# EasyEDA Pro project Rpi power and fan.eprj

# Schematic Schematic1
Board Name: Board1; Create Date: 2025-11-11; Page Name: P1; Project Name: Rpi power and fan; Schematic Name: Schematic1; Update Date: 2025-11-11; Company: EasyEDA.com; Page Size: A4; Version: V1.0
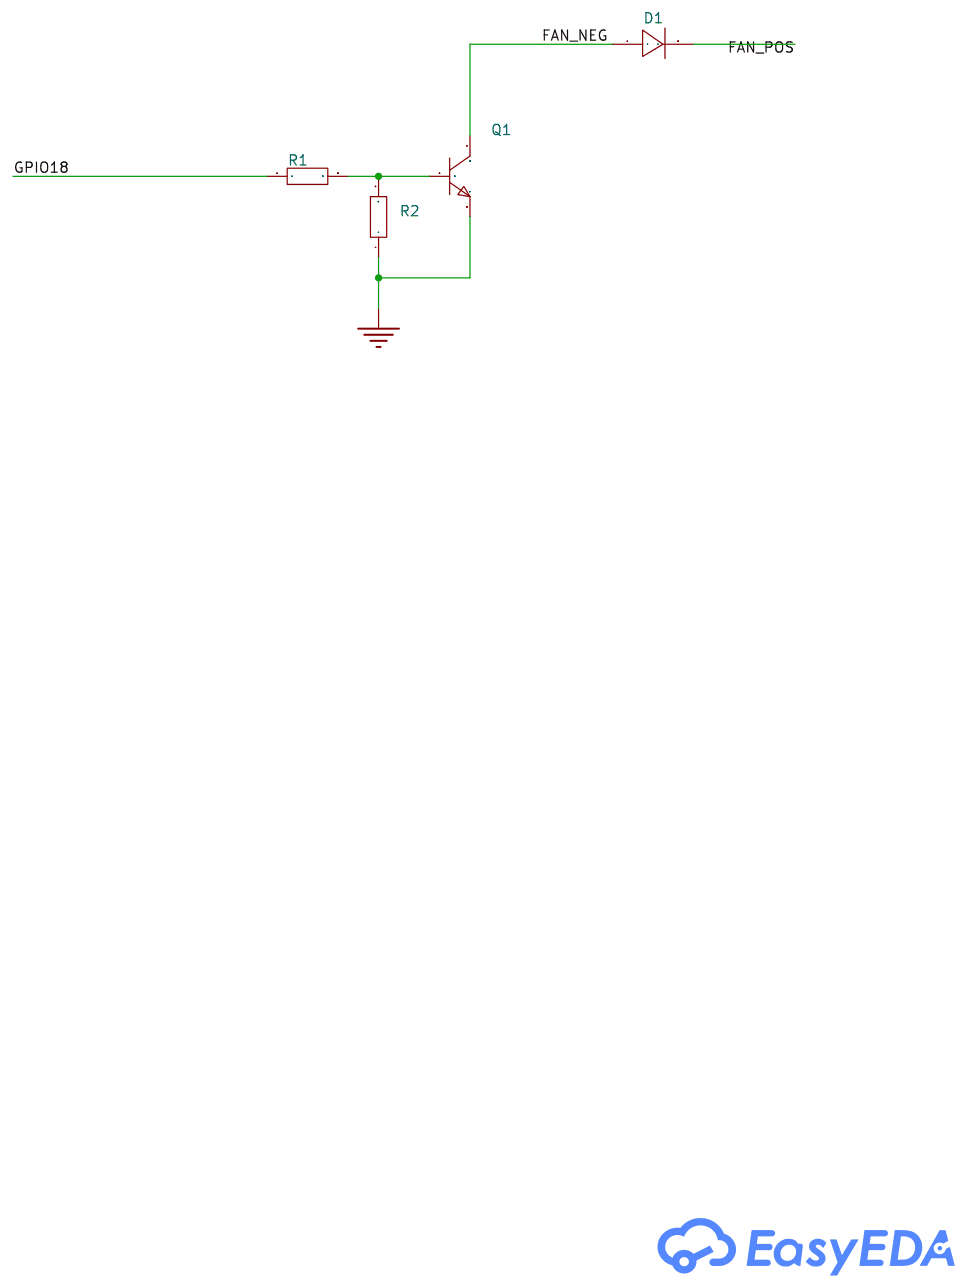
[diagram p0: schematic sheet]

## Parts
D1  -  [DO-41_BD2.8-L4.2-P8.00-D0.7-FD]
Q1  -  [TO-92-3_L4.8-W3.7-P2.54-L]
R1  2.4kΩ  [R0402]
R2  10kΩ  [R0805]

## Library data of the parts
D1 = UF4007: LCSC Part Name: 1kV 1A 75ns; Supplier Part: C232764; Manufacturer: onsemi(安森美); Supplier Footprint: DO-41; JLCPCB Part Class: Extended Part; Datasheet: https://atta.szlcsc.com/upload/public/pdf/source/20181222/C232764_DCD93948AF2F445729824FC64E235A98.pdf; Supplier: LCSC; Forward Voltage (Vf@If): 1.7V@1A; Reverse Leakage Current: 10μA@1kV; Operating Temperature: -65℃~+150℃@(Tj)
Q1 = BC547BTA: Supplier Part: C258144; Manufacturer: onsemi(安森美); Supplier Footprint: TO-92-3L; JLCPCB Part Class: Extended Part; Datasheet: https://atta.szlcsc.com/upload/public/pdf/source/20181011/C258144_558FF79AFD5DFF45A84CD9911C86EE0E.pdf; Supplier: LCSC; Collector-Emitter Saturation Voltage (VCE(sat)@Ic,Ib): 250mV@100mA,5mA; DC Current Gain (hFE@Ic,Vce): 200@2mA,5V; Transition Frequency (fT): 300MHz; Operating Temperature: +150℃@(Tj)
R1 = RC0402FR-072K4L: LCSC Part Name: 2.4kΩ ±1% 62.5mW; Supplier Part: C112296; Manufacturer: YAGEO(国巨); Supplier Footprint: 0402; JLCPCB Part Class: Extended Part; Datasheet: https://atta.szlcsc.com/upload/public/pdf/source/20170912/C112296_1505207745650963374.pdf; Supplier: LCSC; Type: Thick Film Resistors; Tolerance: ±1%; Temperature Coefficient: ±100ppm/℃; Operating Temperature Range: -55℃~+155℃
R2 = RMCF0805FT10K0: LCSC Part Name: 10kΩ ±1%; Supplier Part: C237755; Manufacturer: SEI(Stackpole Electronics Inc.); Supplier Footprint: 0805; JLCPCB Part Class: Extended Part; Datasheet: https://atta.szlcsc.com/upload/public/pdf/source/20181205/C237755_30FA738726C69E37C86821B0BDD56A4F.pdf; Supplier: LCSC

## Nets
GND: Q1.3(E) R2.1
FAN_NEG: D1.1(A) Q1.1(C)
FAN_POS: D1.2(K)
GPIO18: R1.1
$1N219: Q1.2(B) R1.2 R2.2

# Board PCB1
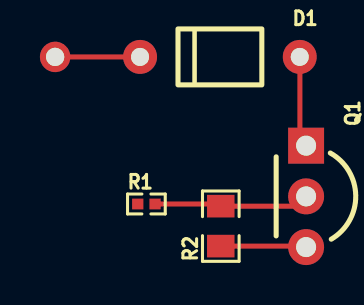
[diagram p1: board, top side]
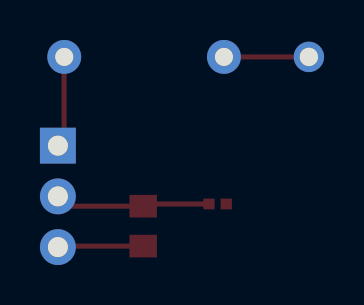
[diagram p2: board, bottom side, seen from below]

No outline. copper layers: Top Layer, Bottom Layer. Coordinates in mm from the lowest, leftmost part position.
Stack: Top Layer 0.035mm / Dielectric1 1.51mm FR4 er 4.5 / Bottom Layer 0.035mm

## Design rules (mm)
template: JLCPCB Capability(Two Layers Board)
spacing copperThickness1oz (default): track to track 0.102, other pairs 0.152 to 0.3
spacing copperThickness2oz: track to track 0.203, other pairs 0.152 to 0.3
track width copperThickness1oz (default): min 0.127, default 0.254, max 2.54
track width copperThickness2oz: min 0.203, default 0.254, max 2.54
differential pair differentialPair (default): width min 0.127, default 0.254, max 2.54; gap min 0.152, default 0.152
via viaSize (default): diameter min 0.5, default 0.61, max 10; hole min 0.3, default 0.305, max 6.3

## Placement (name value [footprint] x y rotation side)
D1  -  [DO-41_BD2.8-L4.2-P8.00-D0.7-FD]  8.25 8.48 180 top
NOREF  -  [Pad_e30]  0 8.48 0 top
Q1  -  [TO-92-3_L4.8-W3.7-P2.54-L]  12.57 1.49 270 top
R1  2.4kΩ  [R0402]  4.57 1.11 0 top
R2  10kΩ  [R0805]  8.3 0 90 top

## Footprints (pads in the part's own frame, mm; a bottom-side part is the same pattern mirrored in y, then rotated)
DO-41_BD2.8-L4.2-P8.00-D0.7-FD
  round 1.7 hole 0.9: 1(-4,0) 2(4,0)
Pad_e30
  round 1.524 hole 0.914: 1(0,0)
R0402
  rect 0.566x0.54 smd: 1(-0.433,0) 2(0.433,0)
R0805
  rect 1.133x1.377 smd: 1(-1,0) 2(1,0)
TO-92-3_L4.8-W3.7-P2.54-L
  rect 1.8x1.8 hole 1: 1(-2.54,0)
  round 1.8 hole 1: 2(0,0) 3(2.54,0)

## Nets
As in the schematic.

Pads without a net: NOREF 1

## Routing (per net, layer and track width the routed paths; a pad name or vN(x,y) marks a point on that pad's centre or on a via; arc(x,y) is an arc through that point)
GND: length 4.3
  Top Layer w0.254: Q1.3 12.52,-1 R2.1
FAN_NEG: length 5.1
  Top Layer w0.254: Q1.1 12.26,4.34 12.26,8.48 ; D1.1 12.26,8.48 ; 12.26,8.48 12.6,8.83 ; 12.26,8.48 12.26,8.55
$1N219: length 7.8
  Top Layer w0.254: R1.2 8.19,1.11 R2.2 12.08,1 Q1.2
FAN_POS: length 4.3
  Top Layer w0.254: 0,8.48 D1.2
